# EAGLE schematic Maze Schematic (EAGLE 8.7.1)
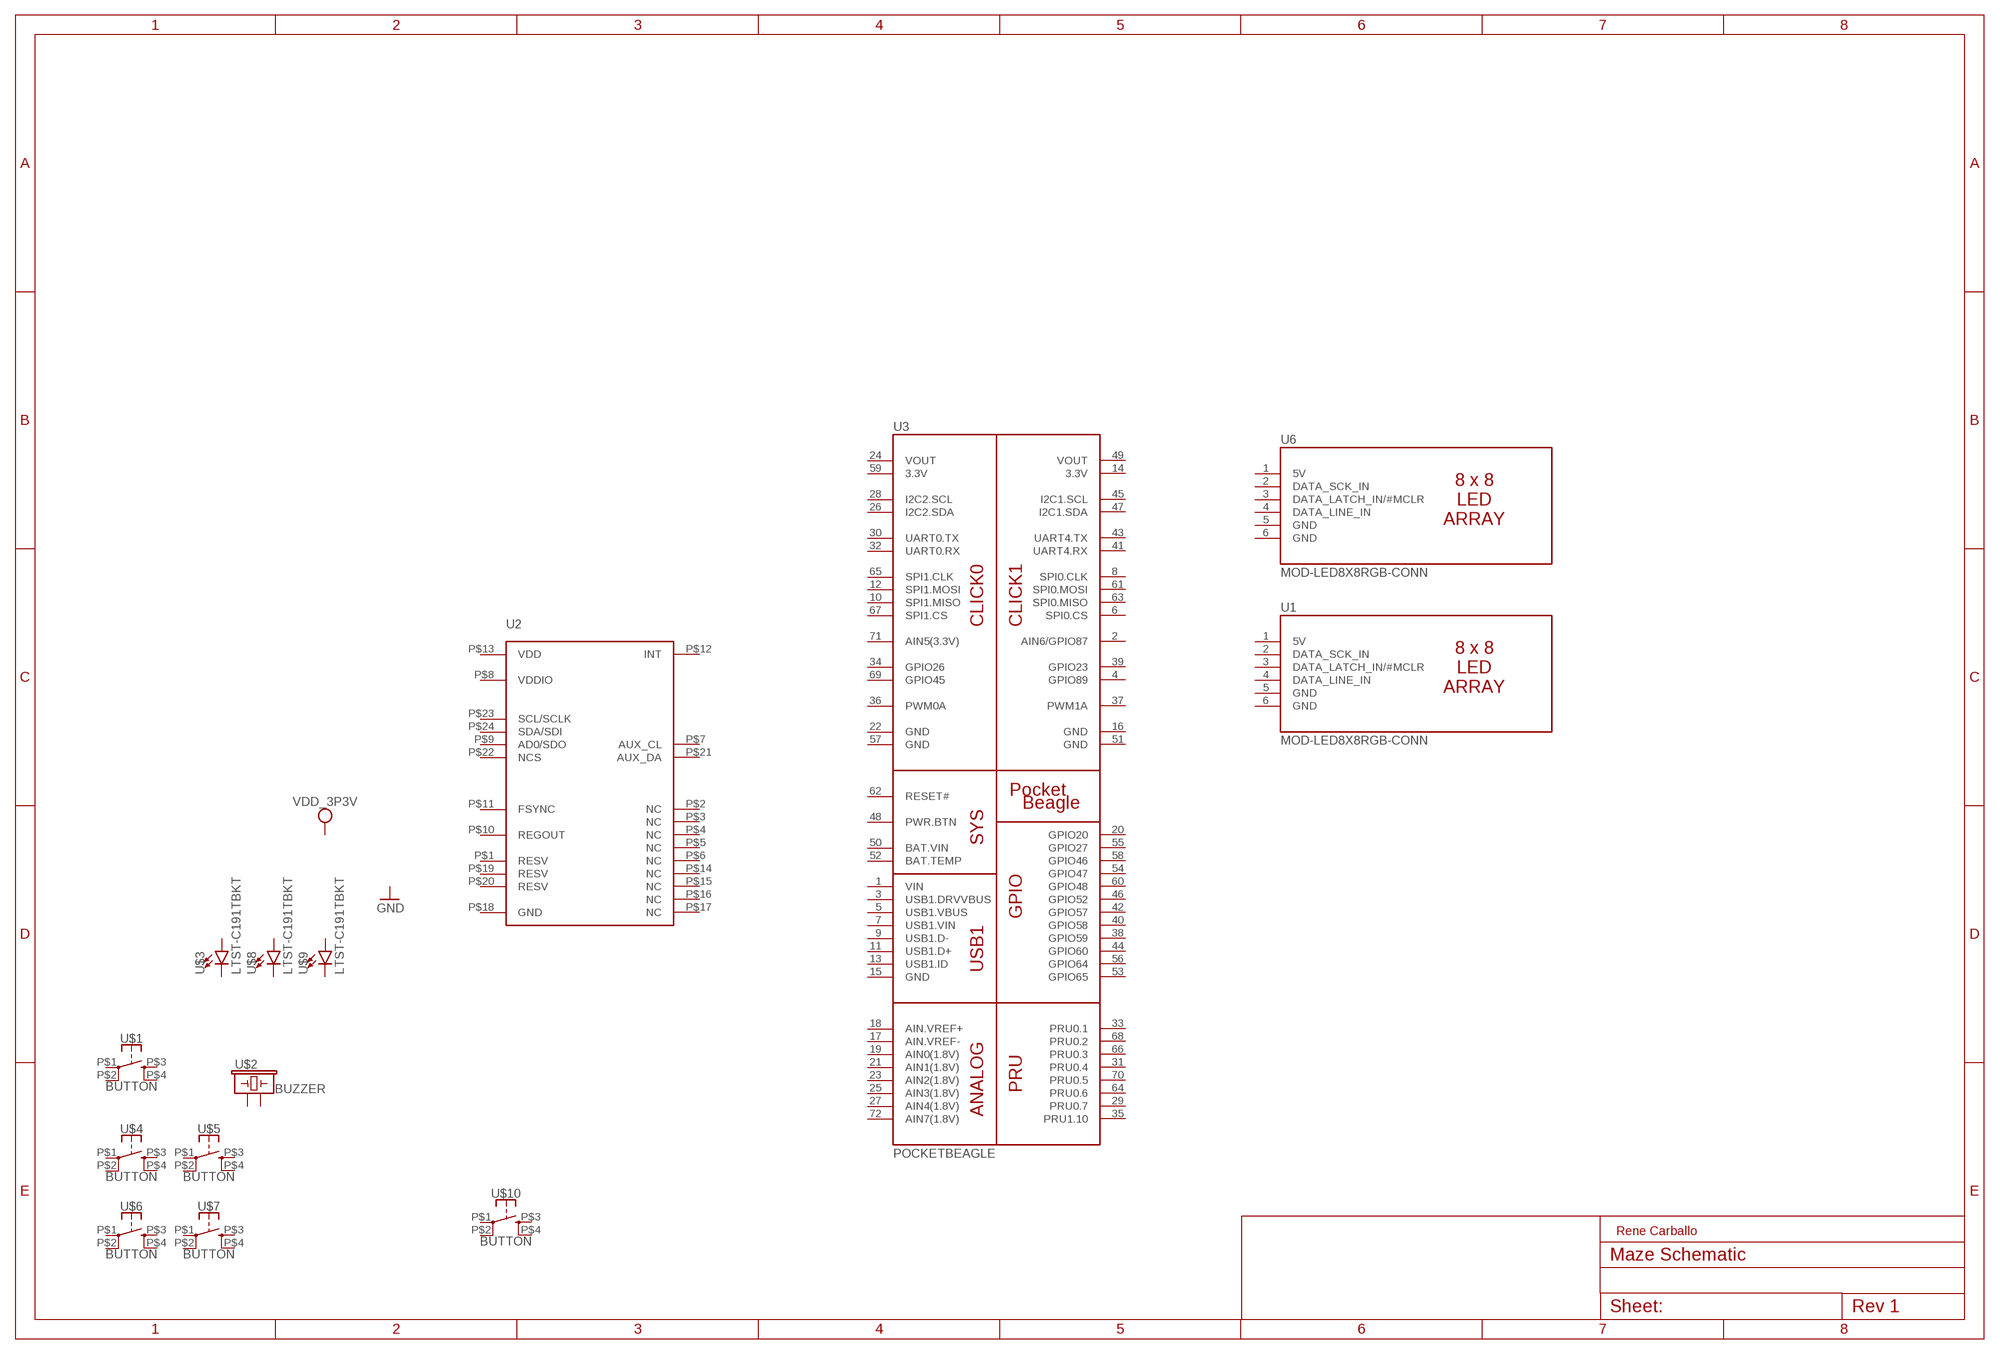
[diagram p0: schematic, sheet 1]

## Parts
U1  MOD-LED8X8RGB-CONN  [FE06W]
U2  MPU-9250  [QFN-3X3MM]
U3  POCKETBEAGLE  [POCKETBEAGLE]
U6  MOD-LED8X8RGB-CONN  [FE06W]
U$1  BUTTON  [BUTTON-11.5X11.7MM]
U$2  BUZZER  [BUZZER-12MM]
U$3  LTST-C191TBKT  [LED-SMD]
U$4  BUTTON  [BUTTON-11.5X11.7MM]
U$5  BUTTON  [BUTTON-11.5X11.7MM]
U$6  BUTTON  [BUTTON-11.5X11.7MM]
U$7  BUTTON  [BUTTON-11.5X11.7MM]
U$8  LTST-C191TBKT  [LED-SMD]
U$9  LTST-C191TBKT  [LED-SMD]
U$10  BUTTON  [BUTTON-11.5X11.7MM]
Unconnected: U1.1(5V) U1.2(DATA_SCK_IN) U1.3(DATA_LATCH_IN/#MCLR) U1.4(DATA_LINE_IN) U1.5(GND) U1.6(GND) U2.P$1(RESV) U2.P$2(NC) U2.P$3(NC) U2.P$4(NC) U2.P$5(NC) U2.P$6(NC) U2.P$7(AUX_CL) U2.P$8(VDDIO) U2.P$9(AD0/SDO) U2.P$10(REGOUT) U2.P$11(FSYNC) U2.P$12(INT) U2.P$13(VDD) U2.P$14(NC) U2.P$15(NC) U2.P$16(NC) U2.P$17(NC) U2.P$18(GND) U2.P$19(RESV) U2.P$20(RESV) U2.P$21(AUX_DA) U2.P$22(NCS) U2.P$23(SCL/SCLK) U2.P$24(SDA/SDI) U3.1(VIN) U3.2(AIN6/GPIO87) U3.3(USB1.DRVVBUS) U3.4(GPIO89) U3.5(USB1.VBUS) U3.6(SPI0.CS) U3.7(USB1.VIN) U3.8(SPI0.CLK) U3.9(USB1.D-) U3.10(SPI1.MISO) U3.11(USB1.D+) U3.12(SPI1.MOSI) U3.13(USB1.ID) U3.14(3.3V) U3.15(GND) U3.16(GND) U3.17(AIN.VREF-) U3.18(AIN.VREF+) U3.19(AIN0(1.8V)) U3.20(GPIO20) U3.21(AIN1(1.8V)) U3.22(GND) U3.23(AIN2(1.8V)) U3.24(VOUT) U3.25(AIN3(1.8V)) U3.26(I2C2.SDA) U3.27(AIN4(1.8V)) U3.28(I2C2.SCL) U3.29(PRU0.7) U3.30(UART0.TX) U3.31(PRU0.4) U3.32(UART0.RX) U3.33(PRU0.1) U3.34(GPIO26) U3.35(PRU1.10) U3.36(PWM0A) U3.37(PWM1A) U3.38(GPIO59) U3.39(GPIO23) U3.40(GPIO58) U3.41(UART4.RX) U3.42(GPIO57) U3.43(UART4.TX) U3.44(GPIO60) U3.45(I2C1.SCL) U3.46(GPIO52) U3.47(I2C1.SDA) U3.48(PWR.BTN) U3.49(VOUT) U3.50(BAT.VIN) U3.51(GND) U3.52(BAT.TEMP) U3.53(GPIO65) U3.54(GPIO47) U3.55(GPIO27) U3.56(GPIO64) U3.57(GND) U3.58(GPIO46) U3.59(3.3V) U3.60(GPIO48) U3.61(SPI0.MOSI) U3.62(RESET#) U3.63(SPI0.MISO) U3.64(PRU0.6) U3.65(SPI1.CLK) U3.66(PRU0.3) U3.67(SPI1.CS) U3.68(PRU0.2) U3.69(GPIO45) U3.70(PRU0.5) U3.71(AIN5(3.3V)) U3.72(AIN7(1.8V)) U6.1(5V) U6.2(DATA_SCK_IN) U6.3(DATA_LATCH_IN/#MCLR) U6.4(DATA_LINE_IN) U6.5(GND) U6.6(GND) U$1.P$1 U$1.P$2 U$1.P$3 U$1.P$4 U$2.+ U$2.- U$3.A(+) U$3.C(-) U$4.P$1 U$4.P$2 U$4.P$3 U$4.P$4 U$5.P$1 U$5.P$2 U$5.P$3 U$5.P$4 U$6.P$1 U$6.P$2 U$6.P$3 U$6.P$4 U$7.P$1 U$7.P$2 U$7.P$3 U$7.P$4 U$8.A(+) U$8.C(-) U$9.A(+) U$9.C(-) U$10.P$1 U$10.P$2 U$10.P$3 U$10.P$4

## Notes on the sheet
- Rene Carballo

## Library data of the parts
U1 U6 = Buzzer Box:MOD-LED8X8RGB-CONN
U2 = Buzzer Box:MPU-9250
U3 = Buzzer Box:POCKETBEAGLE
U$1 U$4-U$7 U$10 = Buzzer Box:BUTTON
U$2 = Buzzer Box:BUZZER
U$3 U$8 U$9 = Buzzer Box:LTST-C191TBKT